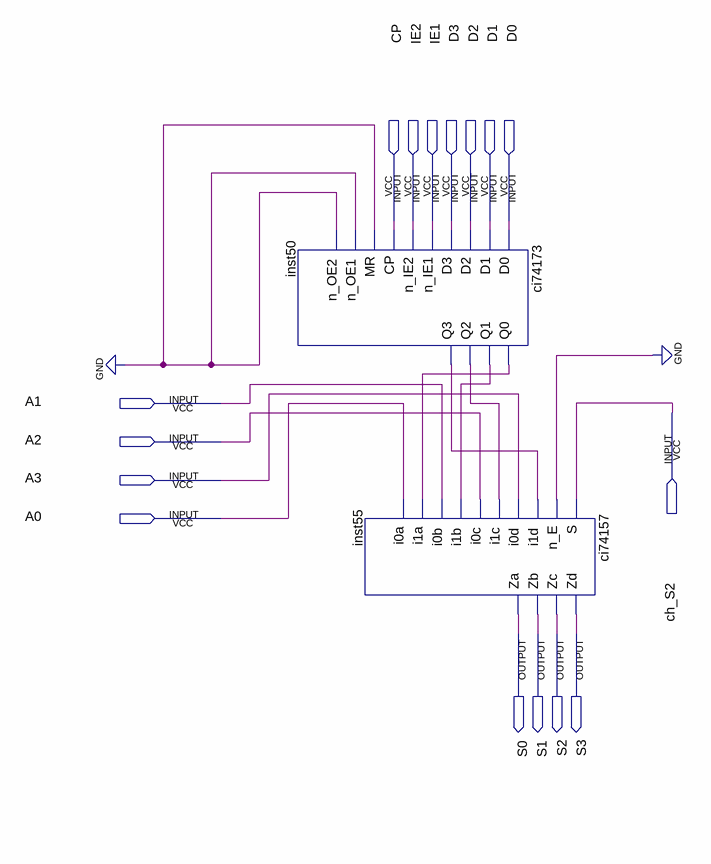
[diagram p0: schematic sheet]
// Quartus schematic REMAndMUX.bdf as structural Verilog: 2 symbols, 16 pins
module REMAndMUX (
  input  CP,
  input  IE2,
  input  IE1,
  input  D3,
  input  D2,
  input  D1,
  input  D0,
  input  A1,
  input  ch_S2,
  input  A2,
  input  A3,
  input  A0,
  output S0,
  output S1,
  output S2,
  output S3
);

  wire inst50_q0, inst50_q1, inst50_q2, inst50_q3;

  ci74173 inst50 (
    .D0(D0), .D1(D1), .D2(D2), .D3(D3), .n_IE1(IE1), .n_IE2(IE2), .CP(CP), .MR(1'b0), .n_OE1(1'b0),
    .n_OE2(1'b0), .Q0(inst50_q0), .Q1(inst50_q1), .Q2(inst50_q2), .Q3(inst50_q3));
  ci74157 inst55 (
    .S(ch_S2), .n_E(1'b0), .i1d(inst50_q3), .i0d(A3), .i1c(inst50_q2), .i0c(A2), .i1b(inst50_q1), .i0b(A1),
    .i1a(inst50_q0), .i0a(A0), .Zd(S3), .Zc(S2), .Zb(S1), .Za(S0));
endmodule
